# Altium schematic sheet Sic_PowerBoard.SchDoc
size A3
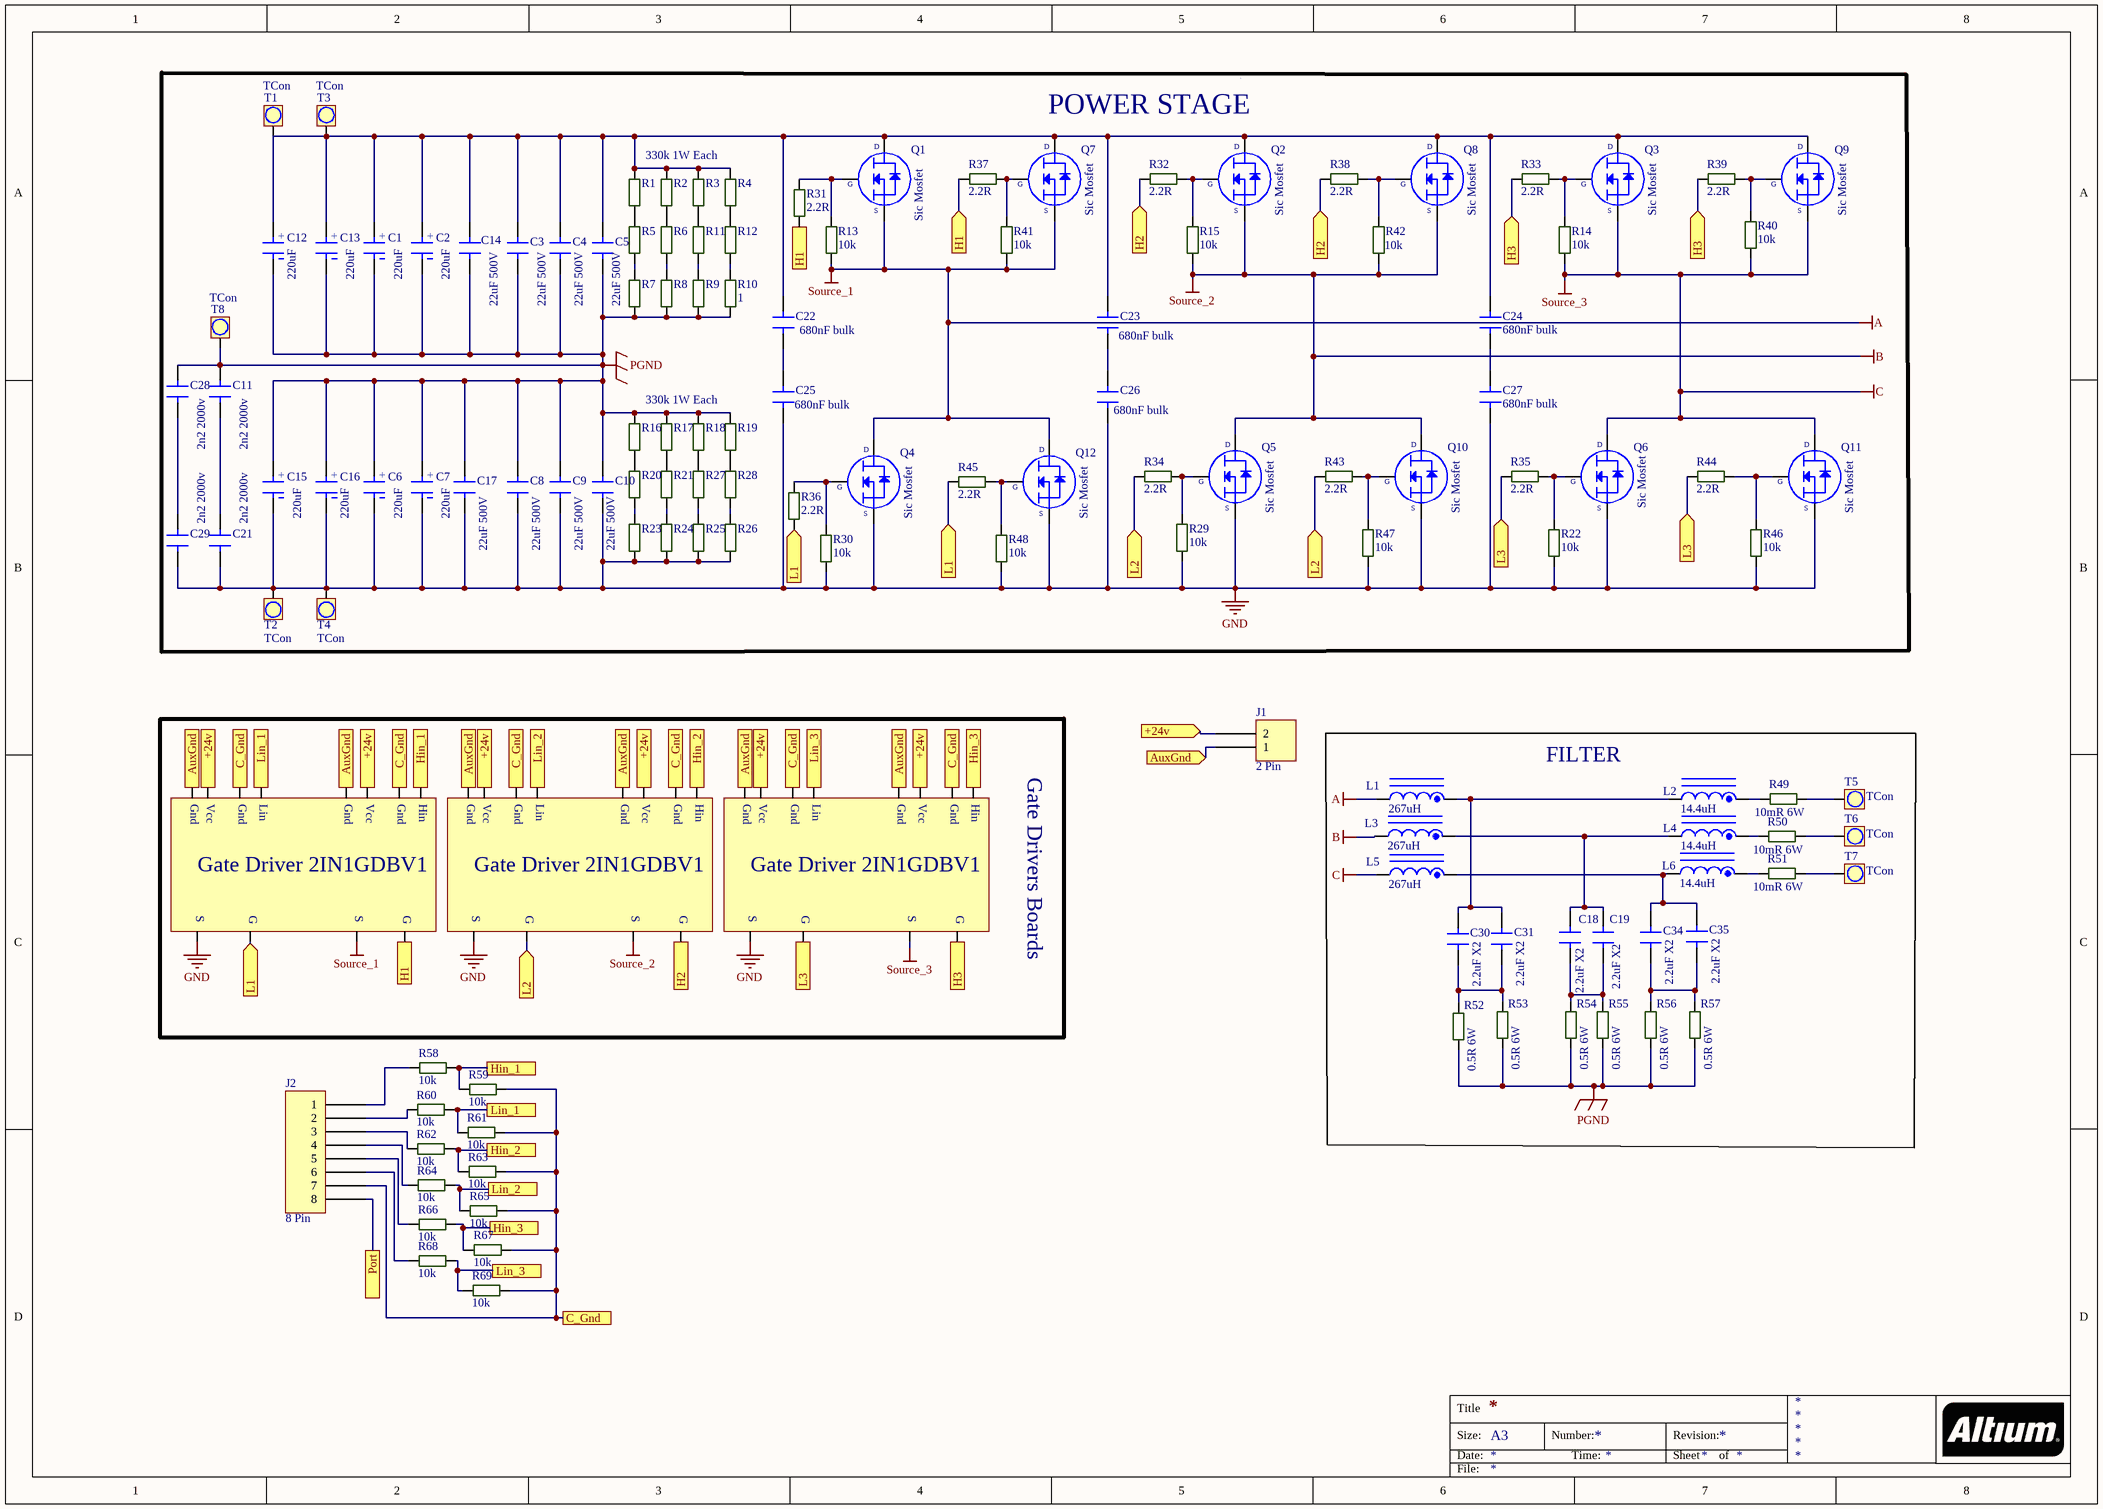
[diagram p0: Sic_PowerBoard.SchDoc]

## Parts
C1  220uF  [CAP.EL.220uF 500V]
C2  220uF  [CAP.EL.220uF 500V]
C3  22uF 500V  [CAP.POL 22UF 500VDC - duplicate]
C4  22uF 500V  [CAP.POL 22UF 500VDC - duplicate]
C5  22uF 500V  [CAP.POL 22UF 500VDC - duplicate]
C6  220uF  [CAP.EL.220uF 500V]
C7  220uF  [CAP.EL.220uF 500V]
C8  22uF 500V  [CAP.POL 22UF 500VDC - duplicate]
C9  22uF 500V  [CAP.POL 22UF 500VDC - duplicate]
C10  22uF 500V  [CAP.POL 22UF 500VDC - duplicate]
C11  2n2 2000v  [2n2 2000v]
C12  220uF  [CAP.EL.220uF 500V]
C13  220uF  [CAP.EL.220uF 500V]
C14  22uF 500V  [CAP.POL 22UF 500VDC - duplicate]
C15  220uF  [CAP.EL.220uF 500V]
C16  220uF  [CAP.EL.220uF 500V]
C17  22uF 500V  [CAP.POL 22UF 500VDC - duplicate]
C18  2.2uF X2  [CAP.POL 2.2UF  x2]
C19  2.2uF X2  [CAP.POL 2.2UF  x2]
C21  2n2 2000v  [2n2 2000v]
C22  680nF bulk  [680nF bulk]
C23  680nF bulk  [680nF bulk]
C24  680nF bulk  [680nF bulk]
C25  680nF bulk  [680nF bulk]
C26  680nF bulk  [680nF bulk]
C27  680nF bulk  [680nF bulk]
C28  2n2 2000v  [2n2 2000v]
C29  2n2 2000v  [2n2 2000v]
C30  2.2uF X2  [CAP.POL 2.2UF  x2]
C31  2.2uF X2  [CAP.POL 2.2UF  x2]
C34  2.2uF X2  [CAP.POL 2.2UF  x2]
C35  2.2uF X2  [CAP.POL 2.2UF  x2]
G1  GateDriver Board  [Gate Driver]  (value not drawn)
G2  GateDriver Board  [Gate Driver]  (value not drawn)
G3  GateDriver Board  [Gate Driver]  (value not drawn)
J1  2 Pin  [2pin]
J2  8 Pin  [8 pin connector]
L1  267uH  [Linverter]
L2  14.4uH  [Lgrid]
L3  267uH  [Linverter]
L4  14.4uH  [Lgrid]
L5  267uH  [Linverter]
L6  14.4uH  [Lgrid]
Q1  Sic Mosfet  [IFX-PG-TO247-3-41]
Q2  Sic Mosfet  [IFX-PG-TO247-3-41]
Q3  Sic Mosfet  [IFX-PG-TO247-3-41]
Q4  Sic Mosfet  [IFX-PG-TO247-3-41]
Q5  Sic Mosfet  [IFX-PG-TO247-3-41]
Q6  Sic Mosfet  [IFX-PG-TO247-3-41]
Q7  Sic Mosfet  [IFX-PG-TO247-3-41]
Q8  Sic Mosfet  [IFX-PG-TO247-3-41]
Q9  Sic Mosfet  [IFX-PG-TO247-3-41]
Q10  Sic Mosfet  [IFX-PG-TO247-3-41]
Q11  Sic Mosfet  [IFX-PG-TO247-3-41]
Q12  Sic Mosfet  [IFX-PG-TO247-3-41]
R1  330k 1W Each  [R-2512W]
R2  1  [R-2512W]  (value not drawn)
R3  1  [R-2512W]  (value not drawn)
R4  1  [R-2512W]  (value not drawn)
R5  1  [R-2512W]  (value not drawn)
R6  1  [R-2512W]  (value not drawn)
R7  1  [R-2512W]  (value not drawn)
R8  1  [R-2512W]  (value not drawn)
R9  1  [R-2512W]  (value not drawn)
R10  1  [R-2512W]
R11  1  [R-2512W]  (value not drawn)
R12  1  [R-2512W]  (value not drawn)
R13  10k  [R-1206]
R14  10k  [R-1206]
R15  10k  [R-1206]
R16  330k 1W Each  [R-2512W]
R17  1  [R-2512W]  (value not drawn)
R18  1  [R-2512W]  (value not drawn)
R19  1  [R-2512W]  (value not drawn)
R20  1  [R-2512W]  (value not drawn)
R21  1  [R-2512W]  (value not drawn)
R22  10k  [R-1206]
R23  1  [R-2512W]  (value not drawn)
R24  1  [R-2512W]  (value not drawn)
R25  1  [R-2512W]  (value not drawn)
R26  1  [R-2512W]  (value not drawn)
R27  1  [R-2512W]  (value not drawn)
R28  1  [R-2512W]  (value not drawn)
R29  10k  [R-1206]
R30  10k  [R-1206]
R31  2.2R  [R-2512W]
R32  2.2R  [R-2512W]
R33  2.2R  [R-2512W]
R34  2.2R  [R-2512W]
R35  2.2R  [R-2512W]
R36  2.2R  [R-2512W]
R37  2.2R  [R-2512W]
R38  2.2R  [R-2512W]
R39  2.2R  [R-2512W]
R40  10k  [R-1206]
R41  10k  [R-1206]
R42  10k  [R-1206]
R43  2.2R  [R-2512W]
R44  2.2R  [R-2512W]
R45  2.2R  [R-2512W]
R46  10k  [R-1206]
R47  10k  [R-1206]
R48  10k  [R-1206]
R49  10mR 6W  [R-2512W]
R50  10mR 6W  [R-2512W]
R51  10mR 6W  [R-2512W]
R52  0.5R 6W  [R-2512W]
R53  0.5R 6W  [R-2512W]
R54  0.5R 6W  [R-2512W]
R55  0.5R 6W  [R-2512W]
R56  0.5R 6W  [R-2512W]
R57  0.5R 6W  [R-2512W]
R58  10k  [R-1206]
R59  10k  [R-1206]
R60  10k  [R-1206]
R61  10k  [R-1206]
R62  10k  [R-1206]
R63  10k  [R-1206]
R64  10k  [R-1206]
R65  10k  [R-1206]
R66  10k  [R-1206]
R67  10k  [R-1206]
R68  10k  [R-1206]
R69  10k  [R-1206]
T1  TCon  [tCon]
T2  TCon  [tCon]
T3  TCon  [tCon]
T4  TCon  [tCon]
T5  TCon  [tCon]
T6  TCon  [tCon]
T7  TCon  [tCon]
T8  TCon  [tCon]

## Blocks framed on the sheet
POWER STAGE: C1-C17 C21-C29 Q1-Q12 R1-R48 T1-T4 T8
Gate Drivers Boards: G1-G3
FILTER: C18 C19 C30 C31 C34 C35 L1-L6 R49-R57 T5-T7

## Ports
+24v, +24v (in), AuxGnd, AuxGnd (in), C_Gnd, H1 (in), H2 (in), H3 (in), Hin_1, Hin_2, Hin_3, L1 (in), L2 (in), L3 (in), Lin_1, Lin_2, Lin_3, Port

## Nets
A: G1.10 L1.2 Q1.3 Q4.2 Q7.3 Q12.2 R13.1 R41.1  [also labelled Source_1]
B: G2.10 L3.2 Q2.3 Q5.2 Q8.3 Q10.2 R15.1 R42.1  [also labelled Source_2]
C: G3.10 L5.2 Q3.3 Q6.2 Q9.3 Q11.2 R14.1 R40.1  [also labelled Source_3]
GND: C6.1 C7.1 C8.1 C9.1 C10.1 C15.1 C16.1 C17.1 C21.2 C25.1 C26.1 C27.1 C29.2 G1.12 G2.12 G3.12 Q4.3 Q5.3 Q6.3 Q10.3 Q11.3 Q12.3 R22.1 R23.1 R24.1 R25.1 R26.1 R29.1 R30.1 R46.1 R47.1 R48.1 T2.1 T4.1
PGND: C1.1 C2.1 C3.1 C4.1 C5.1 C6.2 C7.2 C8.2 C9.2 C10.2 C11.1 C12.1 C13.1 C14.1 C15.2 C16.2 C17.2 C28.1 R7.1 R8.1 R9.1 R10.1 R16.2 R17.2 R18.2 R19.2 R52.1 R53.1 R54.1 R55.1 R56.1 R57.1 T8.1
+24v: G1.3 G1.7 G2.3 G2.7 G3.3 G3.7 J1.2 ; port +24v
AuxGnd: G1.4 G1.8 G2.4 G2.8 G3.4 G3.8 J1.1 ; port AuxGnd
C_Gnd: G1.2 G1.6 G2.2 G2.6 G3.2 G3.6 J2.7 R59.1 R61.1 R63.1 R65.1 R67.1 R69.1 ; port C_Gnd
H1: G1.9 R31.1 R37.1 ; port H1
H2: G2.9 R32.1 R38.1 ; port H2
H3: G3.9 R33.1 R39.1 ; port H3
Hin_1: G1.1 R58.1 R59.2 ; port Hin_1
Hin_2: G2.1 R62.1 R63.2 ; port Hin_2
Hin_3: G3.1 R66.1 R67.2 ; port Hin_3
L1: G1.11 R36.1 R45.1 ; port L1
L2: G2.11 R34.1 R43.1 ; port L2
L3: G3.11 R35.1 R44.1 ; port L3
Lin_1: G1.5 R60.1 R61.2 ; port Lin_1
Lin_2: G2.5 R64.1 R65.2 ; port Lin_2
Lin_3: G3.5 R68.1 R69.2 ; port Lin_3
Port: J2.8 ; port Port
NetC1_2: C1.2 C2.2 C3.2 C4.2 C5.2 C12.2 C13.2 C14.2 C22.2 C23.2 C24.1 Q1.2 Q2.2 Q3.2 Q7.2 Q8.2 Q9.2 R1.2 R2.2 R3.2 R4.2 T1.1 T3.1
NetC11_2: C11.2 C21.1
NetC18_1: C18.1 C19.1 R54.2 R55.2
NetC18_2: C18.2 C19.2 L3.1 L4.2
NetC22_1: C22.1 C25.2
NetC23_1: C23.1 C26.2
NetC24_2: C24.2 C27.2
NetC28_2: C28.2 C29.1
NetC30_1: C30.1 C31.1 R52.2 R53.2
NetC30_2: C30.2 C31.2 L1.1 L2.2
NetC34_1: C34.1 C35.1 R56.2 R57.2
NetC34_2: C34.2 C35.2 L5.1 L6.2
NetJ2_1: J2.1 R58.2
NetJ2_2: J2.2 R60.2
NetJ2_3: J2.3 R62.2
NetJ2_4: J2.4 R64.2
NetJ2_5: J2.5 R66.2
NetJ2_6: J2.6 R68.2
NetL2_1: L2.1 R49.2
NetL4_1: L4.1 R50.2
NetL6_1: L6.1 R51.2
NetQ1_1: Q1.1 R13.2 R31.2
NetQ2_1: Q2.1 R15.2 R32.2
NetQ3_1: Q3.1 R14.2 R33.2
NetQ4_1: Q4.1 R30.2 R36.2
NetQ5_1: Q5.1 R29.2 R34.2
NetQ6_1: Q6.1 R22.2 R35.2
NetQ7_1: Q7.1 R37.2 R41.2
NetQ8_1: Q8.1 R38.2 R42.2
NetQ9_1: Q9.1 R39.2 R40.2
NetQ10_1: Q10.1 R43.2 R47.2
NetQ11_1: Q11.1 R44.2 R46.2
NetQ12_1: Q12.1 R45.2 R48.2
NetR1_1: R1.1 R5.2
NetR2_1: R2.1 R6.2
NetR3_1: R3.1 R11.2
NetR4_1: R4.1 R12.2
NetR5_1: R5.1 R7.2
NetR6_1: R6.1 R8.2
NetR9_2: R9.2 R11.1
NetR10_2: R10.2 R12.1
NetR16_1: R16.1 R20.2
NetR17_1: R17.1 R21.2
NetR18_1: R18.1 R27.2
NetR19_1: R19.1 R28.2
NetR20_1: R20.1 R23.2
NetR21_1: R21.1 R24.2
NetR25_2: R25.2 R27.1
NetR26_2: R26.2 R28.1
NetR49_1: R49.1 T5.1
NetR50_1: R50.1 T6.1
NetR51_1: R51.1 T7.1

## Notes on the sheet
- Title
- Size:
- Date:
- A3
- Number:
- Time:
- Revision:
- Sheet
- of
- File:
- (in symbol CAP.EL.220uF 500V) +
- (in symbol GateDriver Board) Gnd; Vcc; Lin; Hin; Gate Driver 2IN1GDBV1; S; G
- (in symbol Sic Mosfet To247) D; G; S

## Library data of the parts
C1 C2 C6 C7 C12 C13 C15 C16 = CAP.EL.220uF 500V: ComponentLink1Description: https://www.ozdisan.com/pasif-komponentler/kondansatorler/aluminyum-kondansatorler/K055002210PM0E040; ComponentLink1URL: https://www.ozdisan.com/pasif-komponentler/kondansatorler/aluminyum-kondansatorler/K055002210PM0E040
C3-C5 C8-C10 C14 C17 = CAP.POL 22UF 500VDC: ComponentLink1Description: https://www.ozdisan.com/pasif-komponentler/kondansatorler/film-kondansatorler/C3D2H226JB00C00; ComponentLink1URL: https://www.ozdisan.com/pasif-komponentler/kondansatorler/film-kondansatorler/C3D2H226JB00C00
L1 L3 L5 = Linverter
L2 L4 L6 = Lgrid
Q1-Q12 = Sic Mosfet To247
R1-R12 R16-R21 R23-R28 R31-R39 R43-R45 = 0207 melf: ComponentLink1Description: https://www.ozdisan.com/pasif-komponentler/direncler/smt-smd-direncler/M271UFG100KT20; ComponentLink1URL: https://www.ozdisan.com/pasif-komponentler/direncler/smt-smd-direncler/M271UFG100KT20
R13-R15 R22 R29 R30 R40-R42 R46-R48 R58-R69 = R-1206: Res1206
R49-R57 = IsabelShunt: ComponentLink1Description: https://www.ozdisan.com/pasif-komponentler/direncler/smt-smd-direncler/M271UFG100KT20; ComponentLink1URL: https://www.ozdisan.com/pasif-komponentler/direncler/smt-smd-direncler/M271UFG100KT20
T1-T8 = Terminal Connector: ComponentLink1Description: https://www.ozdisan.com/konnektor-baglanti-elemanlari/terminal-konnektorler/vida-tipi-konnektorler/K36-00AH; ComponentLink1URL: https://www.ozdisan.com/konnektor-baglanti-elemanlari/terminal-konnektorler/vida-tipi-konnektorler/K36-00AH